# EAGLE design Tarjeta4 (EAGLE 7.6.0)
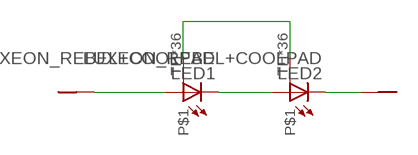
[diagram p0: schematic, sheet 1]

## Parts
LED1  LUXEON_REBEL+COOLPAD  [LUXEON_REBEL+COOLPAD]
LED2  LUXEON_REBEL+COOLPAD  [LUXEON_REBEL+COOLPAD]
U$1  POWER_PIN  [POWER_PIN]
U$2  POWER_PIN  [POWER_PIN]

## Nets
N$1: LED1.A LED1.A@1(A) U$1.P$1
N$2: LED1.C LED1.C@1(C) LED2.A LED2.A@1(A)
N$3: LED2.C LED2.C@1(C) U$2.P$1
N$4: LED1.TH LED1.TH@1 LED1.TH@2 LED1.TH@3 LED1.TH@4 LED1.TH@5 LED1.TH@6 LED1.TH@7 LED1.TH@8 LED1.TH@9 LED1.TH@10 LED1.TH@11 LED1.TH@12 LED1.TH@13 LED1.TH@14 LED1.TH@15 LED1.TH@16 LED1.TH@17 LED1.TH@18 LED1.TH@19 LED1.TH@20 LED1.TH@21 LED1.TH@22 LED1.TH@23 LED1.TH@24 LED1.TH@25 LED1.TH@26 LED1.TH@27 LED1.TH@28 LED1.TH@29 LED1.TH@30 LED1.TH@31 LED1.TH@32 LED1.TH@33 LED1.TH@34 LED1.TH@35 LED2.TH LED2.TH@1 LED2.TH@2 LED2.TH@3 LED2.TH@4 LED2.TH@5 LED2.TH@6 LED2.TH@7 LED2.TH@8 LED2.TH@9 LED2.TH@10 LED2.TH@11 LED2.TH@12 LED2.TH@13 LED2.TH@14 LED2.TH@15 LED2.TH@16 LED2.TH@17 LED2.TH@18 LED2.TH@19 LED2.TH@20 LED2.TH@21 LED2.TH@22 LED2.TH@23 LED2.TH@24 LED2.TH@25 LED2.TH@26 LED2.TH@27 LED2.TH@28 LED2.TH@29 LED2.TH@30 LED2.TH@31 LED2.TH@32 LED2.TH@33 LED2.TH@34 LED2.TH@35

## Library data of the parts
LED1 LED2 = led-lumiled:LUXEON_REBEL+COOLPAD: LUXEON REBEL LED with cooling pads Display Layer Refence in Board for more information Stop and Cream Mask defined by Luxeon Rebel Footprint _customer.dxf; OC_FARNELL: unknown; OC_NEWARK: unknown
U$1 U$2 = ijrobotics:POWER_PIN: POWER PIN

## Board
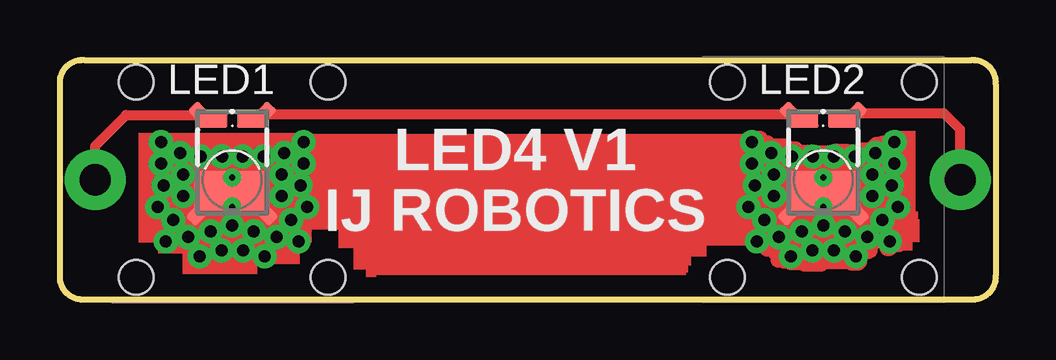
[diagram p1: board, top side]
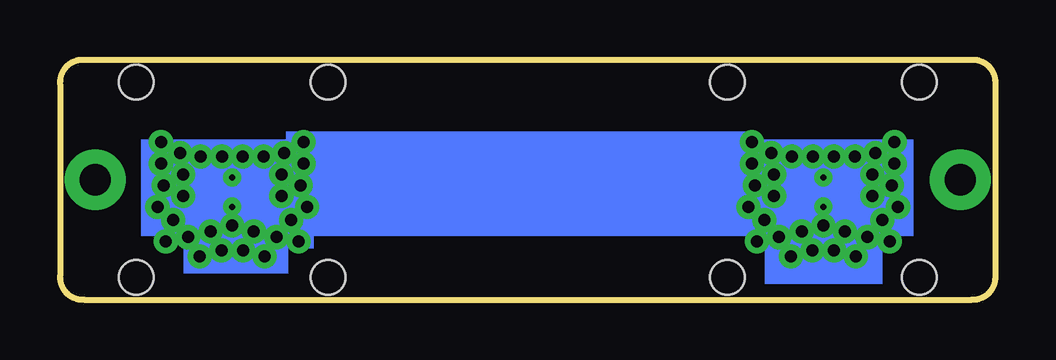
[diagram p2: board, bottom side, seen from below]

Size 39 x 10 mm. Coordinates in mm from the lower left corner, seen from the top.
Outline: 0.93,0 arc-90 0,0.93
Outline: 0,9.07 arc-90 0.93,10
Outline: 38.07,10 arc-90 39,9.07
Outline: 39,0.93 arc-90 38.07,0
Outline: 0,1 0,9
Outline: 1,10 38,10
Outline: 39,9 39,1
Outline: 38,0 1,0
Copper layers (1*16): Top 0.035mm / dielectric 1.5mm / Bottom 0.035mm
Design rules "default": minimum track width 10mil, minimum drill 24mil, track to track 8mil, track to pad 8mil, pad to pad 8mil, via to via 8mil, smd to smd 8mil, copper to edge 40mil, drill to drill 8mil, minimum pad ring 10mil, minimum via ring 8mil, stop-mask expansion 4mil, vias tented up to drill 0mil, thermal gap 10mil
Holes 1.44 mm at 3.18,0.93 3.18,9.07 11.18,9.07 11.18,0.93 35.82,0.93 27.82,0.93 27.82,9.07 35.82,9.07

### Footprints (pad centres in the part's own frame; a part is rotated, then mirrored left to right if it is on the bottom)
LUXEON_REBEL+COOLPAD = smd 1.2 x 0.67: A 0.8,-2.51; C -0.8,-2.51 | smd 1 x 0.6 rotated 315: A@1 1.31,-2.75 | smd 1 x 0.6 rotated 225: C@1 -1.31,-2.75 | smd 2.8 x 1.77: TH 0,0.51 | smd 1 x 0.6 rotated 135: TH@1 -1.39,1.39 | smd 1 x 0.6 rotated 45: TH@2 1.39,1.39 | drill 0.5 pad 0.6: TH@3 2.971,-1.57; TH@4 2.971,-0.67; TH@5 2.85,0.23; TH@6 2.05,0.68; TH@7 2.05,-0.22; TH@8 2.171,-1.12; TH@9 2.764,2.575; TH@10 3.116,1.13; TH@11 2.461,1.687; TH@12 1.844,2.394; TH@13 0.9,2.15; TH@14 0,1.9; TH@15 0.45,2.95; TH@16 1.356,3.196; TH@17 1.31,-0.97; TH@18 0.43,-0.97; TH@21 -2.971,-1.57; TH@22 -2.971,-0.67; TH@23 -2.85,0.23; TH@24 -2.05,0.68; TH@25 -2.05,-0.22; TH@26 -2.171,-1.12; TH@27 -2.764,2.575; TH@28 -3.116,1.13; TH@29 -2.461,1.687; TH@30 -1.844,2.394; TH@31 -0.9,2.15; TH@32 -0.45,2.95; TH@33 -1.356,3.196; TH@34 -1.31,-0.97; TH@35 -0.43,-0.97 | drill 0.25 pad 0.4: TH@19 0,-0.095; TH@20 0,1.125
POWER_PIN = drill 1.3 pad 2.54: P$1 0,0

### Placement (x,y rotation side)
LED1  7.18,5 180 top
LED2  31.82,5 180 top
U$1  1.47,5 0 top
U$2  37.53,5 0 top

### Tracks (layer width: path | path; a pad name or v marks a point on that pad's centre or on a via)
N$1
  Top 0.406: U$1.P$1 1.47,6.41 2.76,7.7 5.82,7.7 LED1.A@1
N$2
  Top 0.406: LED1.C@1 LED2.A@1
N$3
  Top 0.406: U$2.P$1 37.53,7.09 36.86,7.77 33.15,7.77 LED2.C@1
N$4
  Top 0.254: LED1.TH@8 4.66,6.12 LED1.TH@3 LED1.TH@4 4.48,5.4 4.48,4.63 | LED1.TH@5 4.48,4.63 | 4.48,4.63 4.48,4.28 LED1.TH@10 4.16,3.87 LED1.TH@11 4.72,2.73 | 4.72,2.73 LED1.TH@9 | LED1.TH@6 LED1.TH@7 4.88,5.47 4.67,5.47 5.01,5.82 LED1.TH@8 | 4.72,2.73 5.21,2.73 LED1.TH@12 5.34,2.29 LED1.TH@16 | LED1.TH@2 6.28,3.12 LED1.TH@13 6.73,2.4 LED1.TH@15 6.73,2.65 LED1.TH@14 7.18,2.5 LED1.TH@32 7.63,2.4 LED1.TH@31 | LED1.TH@33 8.54,2.39 LED1.TH@31 | LED1.TH@31 8.78,2.85 LED1.TH@30 9.76,2.61 | 9.76,2.61 LED1.TH@27 | 9.76,2.61 9.76,3.19 LED1.TH@29 9.74,3.31 LED1.TH@28 | LED1.TH@28 9.68,3.87 LED1.TH@24 9.58,4.32 LED1.TH@23 | LED1.TH@23 10.15,4.89 LED1.TH@22 LED1.TH@21 9.8,6.57 LED1.TH@26 8.64,6.12 LED1.TH@34 LED1.TH@35 LED1.TH@18 6.64,5.97 6.6,6.01 6.77,6.01 6.79,5.99 5.89,5.99 LED1.TH@17 5.16,5.97 LED1.TH@8 | LED1.TH@25 9.58,5.22 LED1.TH@23 | LED1.TH@28 LED2.TH@10
  Top 0.61: LED2.TH@10 28.7,4.5 LED2.TH@5 28.97,5.55 LED2.TH@4 | LED2.TH@4 LED2.TH@3 | LED2.TH@8 29.3,6.12 LED2.TH@4 | LED2.TH@8 29.65,5.34 LED2.TH@7 LED2.TH@6 29.36,3.91 LED2.TH@11 | LED2.TH@11 29.98,2.7 LED2.TH@12 29.98,2.29 LED2.TH@16 30.92,2.26 | LED2.TH@11 29.36,2.73 LED2.TH@9 | 30.92,2.26 LED2.TH@13 30.92,3.12 LED2.TH@2 | 31.78,2.22 31.61,2.05 LED2.TH@15 31.13,2.05 30.92,2.26 | 31.78,2.22 32.1,2.22 | 32.1,2.22 LED2.TH@32 32.93,2.05 LED2.TH@33 | 31.78,2.22 31.78,3.06 LED2.TH@14 LED2.TH | 32.1,2.22 32.1,2.23 LED2.TH@31 33.42,2.85 | 33.42,2.85 LED2.TH@30 34.4,2.61 LED2.TH@27 34.39,2.62 34.39,3.27 34.35,3.31 | LED2.TH@29 34.35,3.31 | 34.35,3.31 34.38,3.31 LED2.TH@28 | LED2.TH@23 34.32,4.77 | 34.32,4.77 LED2.TH@24 | 34.32,4.77 LED2.TH@25 34.34,5.22 LED2.TH@22 LED2.TH@21 34.44,6.57 LED2.TH@26 33.28,6.12 LED2.TH@34 LED2.TH@35 LED2.TH@18 LED2.TH@17 29.8,5.97 LED2.TH@8 | LED2.TH LED2.TH@20 | 33.42,2.85 33.42,3.4 LED2.TH@1 | LED1.TH LED1.TH@19 LED1.TH@20 | LED1.TH LED1.TH@20 | LED1.TH@20 LED1.TH@14 | 8.78,2.85 8.78,3.76 8.3,4.24 8.3,4.18 8.16,4.04 8.16,4.02 LED1.TH@1 | LED2.TH@19 LED2.TH | LED2.TH 31.82,2.92 31.74,2.84 31.59,2.84 31.36,2.6 31.36,2.38 31.29,2.31 31.29,2.75 30.63,3.41 31.01,3.41 31.15,3.55 31.32,3.55 31.32,3.21 31.4,3.13 31.4,3 31.42,2.97 31.42,3.3 31.57,3.45 31.57,3.51 31.61,3.55 32.08,3.55 32.22,3.69 32.34,3.69 32.82,3.21 32.87,3.21 32.93,3.27 32.49,3.27 32.47,3.26 32.16,3.26 32.06,3.17 32.06,3.09 32.13,3.02 32.16,3.02 32.23,2.95 32.36,2.95 32.45,2.86 32.58,2.86 32.75,2.69 32.8,2.69 32.96,2.53 33.02,2.53 33.21,2.33 33.21,2.26 33.26,2.21 33.26,2.04 33.28,2.03 33.17,2.03 33.06,1.92 32.44,1.92 32.38,1.85 32.15,1.85 32.05,1.95 31.71,1.95 31.65,2.01 31.08,2.01 30.91,1.83 30.46,1.83 30.4,1.9 30.17,1.9 30.12,1.84 29.92,1.64 30.34,1.64 30.45,1.52 30.98,1.52 31.03,1.47 31.74,1.47 31.84,1.57 32.34,1.57 32.34,1.56 32.94,1.56 33,1.51 33.27,1.51 33.34,1.58 33.34,1.83 32.63,1.83 32.2,2.26 31.75,2.26 31.57,2.08 29.97,2.08 29.73,2.32 29.73,2.37 29.66,2.44 29.66,2.32 29.71,2.27 29.71,2.17 29.75,2.12 29.77,2.12 30.3,1.59 30.17,1.59 29.66,2.1 29.47,2.1 29.18,2.38 29.18,2.43 28.97,2.64 29.52,2.64 29.69,2.47 30.43,2.47 30.44,2.46 30.68,2.46 30.72,2.41 30.72,2.67 30.48,2.92 30.29,2.92 30.28,2.91 30.22,2.91 29.82,3.31 29.82,3.37 30.09,3.37 30.15,3.32 30.15,3.88 30.1,3.93 30.11,3.93 30.36,4.18 29.57,4.18 29.55,4.16 29.55,3.95 29.46,3.86 29.46,3.78 29.55,3.68 29.54,3.66 29.54,3.92 29.28,4.18 29.01,4.18 28.87,4.32 29.69,4.32 29.98,4.61 30.09,4.61 30.12,4.63 30.18,4.63 30.25,4.7 30.25,4.76 29.88,5.13 29.7,5.13 29.59,5.02 29.59,4.95 29.79,4.75 29.79,4.54 29.86,4.47 29.6,4.47 29.54,4.53 29.5,4.53 29.23,4.8 29.23,4.81 29.24,4.82 29.24,4.56 28.6,3.92 28.6,3.29 28.69,3.19 28.69,3.23 29.07,3.61 29.5,3.61 29.51,3.62 29.51,3.5 29.34,3.33 29.34,3.17 29.43,3.08 29.09,3.08 29.08,3.09 29.08,3.01 29.12,2.98 29.12,3.97 28.27,4.81 28.27,4.58 28.5,4.35 28.5,4.18 28.44,4.11 28.44,3.83 28.39,3.78 28.39,3.72 28.4,3.72 28.4,4.18 28.46,4.24 28.46,4.43 28.92,4.89 28.74,4.89 28.64,4.99 29.18,4.99 29.42,5.23 30.04,5.23 30.08,5.27 30.36,5.27 30.4,5.23 30.4,5.43 30.29,5.55 30.22,5.55 30.11,5.65 30.11,5.74 29.93,5.92 29.42,5.92 29.4,5.95 30.4,5.95 30.51,5.83 30.05,5.83 29.89,5.68 29.35,5.68 29.23,5.8 29.23,5.84 28.98,6.1 28.97,6.1 28.71,5.84 28.71,5.7 28.57,5.56 28.57,5.19 28.45,5.07 28.45,5.49 28.55,5.59 28.55,6.51 28.66,6.63 28.84,6.63 28.96,6.74 29.2,6.74 29.41,6.54 29.48,6.54 29.61,6.42 30.18,6.42 30.3,6.31 30.66,6.31 30.81,6.16 31.25,6.16 31.26,6.14 31.73,6.14 31.74,6.13 32.26,6.13 32.32,6.19 32.8,6.19 32.84,6.16 32.61,6.16 32.58,6.18 33.74,6.18 33.77,6.21 33.82,6.21 33.83,6.22 34.13,6.22 34.35,6.44 34.39,6.44 34.51,6.56 34.36,6.56 34.34,6.53 34.27,6.53 34.22,6.48 34.02,6.48 33.8,6.25 33.5,6.25 33.47,6.23 33.47,6.13 33.18,5.83 32.9,5.83 32.58,5.52 31.71,5.52 31.52,5.71 30.94,5.71 30.85,5.8 30.8,5.8 30.68,5.68 31.05,5.68 31.23,5.5 31.29,5.5 31.31,5.49 31.7,5.49 31.78,5.41 31.89,5.41 32.16,5.14
  Top 0.61: LED2.TH 33,4.49 33.35,4.84 33.35,5.17 33.26,5.27 33.26,5.42 33.52,5.7 33.91,5.7 34.05,5.55 34.09,5.55 34.22,5.42 34.22,5.06 33.78,4.61 33.67,4.61 33.4,4.33 33.4,4.06 33.38,4.04 33.38,3.83 33.42,3.78 33.45,3.78 33.73,3.49 33.88,3.49 33.88,3.48 33.88,3.63 34.02,3.77 34.02,3.49 33.79,3.26 33.73,3.26 33.45,2.98 33.5,2.98 33.59,2.89 33.71,2.89 33.77,2.83 33.89,2.83 34,2.94 34,2.98 34.04,3.02 34.04,2.94 34.03,2.94 33.99,2.94 33.97,2.92 33.91,2.92 33.86,2.87 33.84,2.87 33.35,2.38 33.35,2.11 33.23,1.99 33.7,1.99 33.76,2.05 33.77,2.05 33.79,2.04 33.79,2.21 34.04,2.46 34.2,2.46 34.21,2.45 34.69,2.45 34.74,2.4 34.85,2.4 | 34.85,2.4 34.87,2.4 34.98,2.3 34.98,2.28 34.77,2.28 34.68,2.19 34.63,2.19 34.56,2.12 34.49,2.12 34.48,2.13 34.58,2.13 34.85,2.4 | 34.85,2.4 34.85,2.76 34.98,2.89 34.99,2.89 34.99,3.33 34.98,3.35 34.98,3.6 34.93,3.64 34.93,3.69 34.8,3.83 34.64,3.83 34.62,3.8 34.62,3.9 34.5,4.01 34.5,4.28 34.33,4.46 34.01,4.46 33.89,4.34 33.82,4.34 33.65,4.17 34.16,4.17 34.46,3.87 34.46,4.05 34.43,4.08 34.82,4.08 34.91,4.17 34.91,4.51 34.88,4.53 34.88,4.87 34.77,4.98 34.77,5.07 34.7,5.14 34.7,5.49 34.73,5.52 34.73,5.62 34.6,5.75 34.5,5.75 34.39,5.86 34.37,5.86 34.33,5.9 34.33,6.33 34.42,6.42 34.28,6.42 34.08,6.23 34.06,6.23 33.65,5.82 33.64,5.82 33.27,5.45 33.26,5.45 33.19,5.38 33.1,5.38 33.01,5.29 33.26,5.29 33.51,5.04 33.8,5.04 33.97,4.87 33.97,4.84 34.02,4.79 34.02,4.89 34.13,5 33.69,5 33.36,5.33 33.36,5.39 33.12,5.63 32.97,5.63 32.8,5.47 32.8,5.41 32.74,5.34 32.74,5.39 32.97,5.62 32.97,5.49 32.34,4.86 32.1,4.86 31.87,5.09
  Top 0.61: LED1.TH LED2.TH
(copper drawn outside any net)
  shapes: Bottom area x6, Top area x19

### Text on the board
tNames: LED4 V1 | IJ ROBOTICS